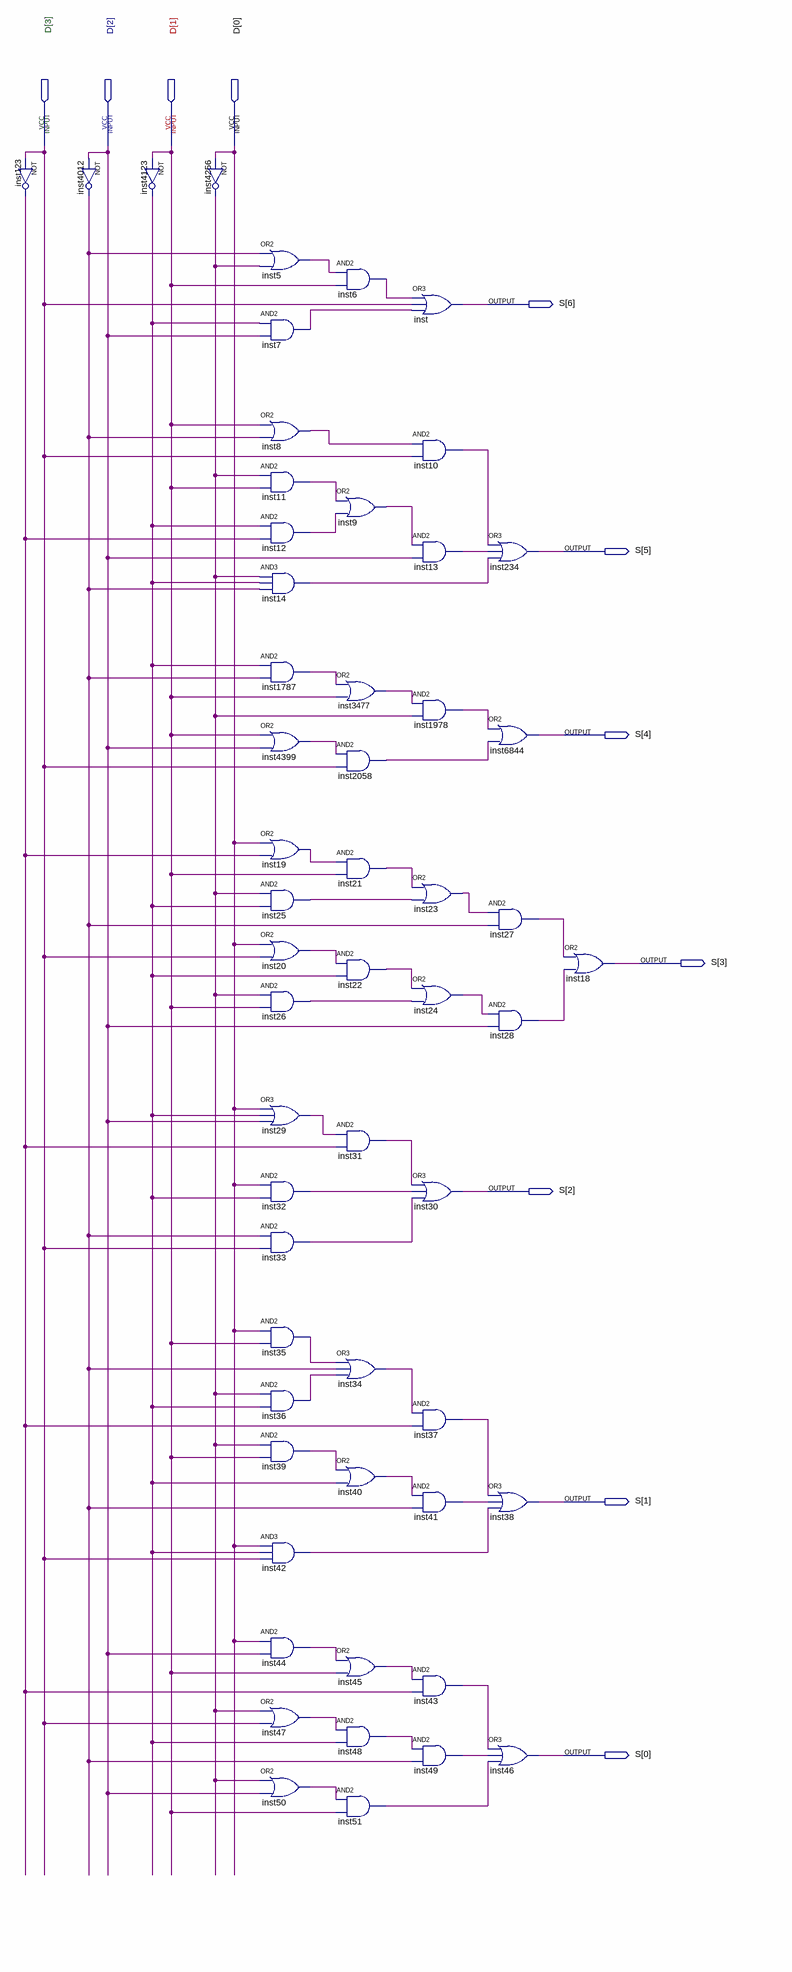
[diagram p0: schematic sheet]
// Quartus schematic seven_segment_decoder.bdf as structural Verilog: 56 symbols, 11 pins
module seven_segment_decoder (
  input  [3:0] D,
  output [6:0] S
);

  wire inst5_out, inst6_out, inst7_out, inst8_out, inst9_out, inst10_out, inst11_out, inst12_out, inst13_out,
       inst14_out, inst19_out, inst20_out, inst21_out, inst22_out, inst23_out, inst24_out, inst25_out,
       inst26_out, inst27_out, inst28_out, inst29_out, inst31_out, inst32_out, inst33_out, inst34_out,
       inst35_out, inst36_out, inst37_out, inst39_out, inst40_out, inst41_out, inst42_out, inst43_out,
       inst44_out, inst45_out, inst47_out, inst48_out, inst49_out, inst50_out, inst51_out, inst123_out,
       inst1787_out, inst1978_out, inst2058_out, inst3477_out, inst4012_out, inst4123_out, inst4256_out,
       inst4399_out;

  not inst123 (inst123_out, D[3]);
  not inst4012 (inst4012_out, D[2]);
  not inst4123 (inst4123_out, D[1]);
  not inst4256 (inst4256_out, D[0]);
  or inst5 (inst5_out, inst4012_out, inst4256_out);
  and inst7 (inst7_out, inst4123_out, D[2]);
  or inst8 (inst8_out, D[1], inst4012_out);
  and inst11 (inst11_out, inst4256_out, D[1]);
  and inst12 (inst12_out, inst4123_out, inst123_out);
  and inst14 (inst14_out, inst4256_out, inst4123_out, inst4012_out);
  and inst1787 (inst1787_out, inst4123_out, inst4012_out);
  or inst4399 (inst4399_out, D[1], D[2]);
  or inst19 (inst19_out, D[0], inst123_out);
  and inst25 (inst25_out, inst4256_out, inst4123_out);
  or inst20 (inst20_out, D[0], D[3]);
  and inst26 (inst26_out, inst4256_out, D[1]);
  or inst29 (inst29_out, D[0], inst4123_out, D[2]);
  and inst32 (inst32_out, D[0], inst4123_out);
  and inst33 (inst33_out, inst4012_out, D[3]);
  and inst35 (inst35_out, D[0], D[1]);
  and inst36 (inst36_out, inst4256_out, inst4123_out);
  and inst39 (inst39_out, inst4256_out, D[1]);
  and inst42 (inst42_out, D[0], inst4123_out, D[3]);
  and inst44 (inst44_out, D[0], D[2]);
  or inst47 (inst47_out, inst4256_out, D[3]);
  or inst50 (inst50_out, inst4256_out, D[2]);
  and inst6 (inst6_out, inst5_out, D[1]);
  or inst9 (inst9_out, inst11_out, inst12_out);
  or inst3477 (inst3477_out, inst1787_out, D[1]);
  and inst2058 (inst2058_out, inst4399_out, D[3]);
  and inst21 (inst21_out, inst19_out, D[1]);
  and inst22 (inst22_out, inst20_out, inst4123_out);
  and inst31 (inst31_out, inst29_out, inst123_out);
  or inst34 (inst34_out, inst35_out, inst4012_out, inst36_out);
  or inst40 (inst40_out, inst39_out, inst4123_out);
  or inst45 (inst45_out, inst44_out, D[1]);
  and inst48 (inst48_out, inst47_out, inst4123_out);
  and inst51 (inst51_out, inst50_out, D[1]);
  or inst (S[6], inst6_out, D[3], inst7_out);
  and inst10 (inst10_out, inst8_out, D[3]);
  and inst13 (inst13_out, inst9_out, D[2]);
  and inst1978 (inst1978_out, inst3477_out, inst4256_out);
  or inst23 (inst23_out, inst21_out, inst25_out);
  or inst24 (inst24_out, inst22_out, inst26_out);
  or inst30 (S[2], inst31_out, inst32_out, inst33_out);
  and inst37 (inst37_out, inst34_out, inst123_out);
  and inst41 (inst41_out, inst40_out, inst4012_out);
  and inst43 (inst43_out, inst45_out, inst123_out);
  and inst49 (inst49_out, inst48_out, inst4012_out);
  or inst234 (S[5], inst10_out, inst13_out, inst14_out);
  or inst6844 (S[4], inst1978_out, inst2058_out);
  and inst27 (inst27_out, inst23_out, inst4012_out);
  and inst28 (inst28_out, inst24_out, D[2]);
  or inst38 (S[1], inst37_out, inst41_out, inst42_out);
  or inst46 (S[0], inst43_out, inst49_out, inst51_out);
  or inst18 (S[3], inst27_out, inst28_out);
endmodule
